# EAGLE design ds_gig_master (EAGLE 5.02)
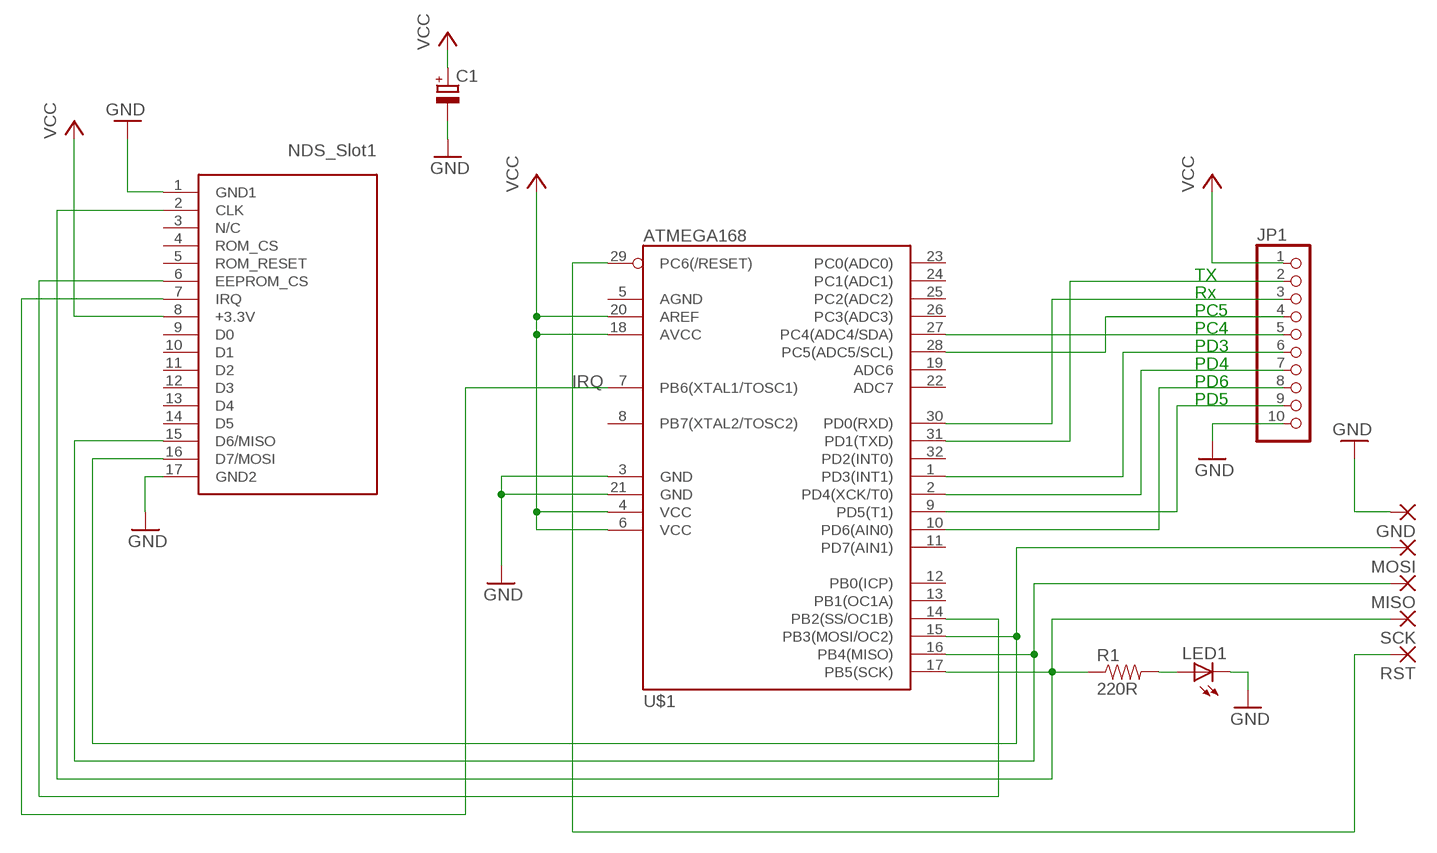
[diagram p0: schematic, sheet 1]

## Parts
C1  CPOL-EUSMCA  [SMC_A]
GND  SMD2  [SMD2]
JP1  PINHD-1X10  [1X10]
LED1  LED0603  [LED-0603]
MISO  SMD2  [SMD2]
MOSI  SMD2  [SMD2]
R1  220R  RESISTOR1206  [1206]
RST  SMD2  [SMD2]
SCK  SMD2  [SMD2]
U$1  ATMEGA168  [TQFP32-08]
U$2  M3_CARTRIDGE  [M3_CARTRIDGE]

## Nets
GND: C1.- GND.1(P) JP1.10 LED1.C U$1.3(GND) U$1.21(GND) U$2.1(GND1) U$2.17(GND2)
N$1: JP1.3 U$1.30(PD0(RXD))
N$2: R1.1 SCK.1(P) U$1.17(PB5(SCK)) U$2.2(CLK)
N$3: JP1.5 U$1.27(PC4(ADC4/SDA))
N$4: LED1.A R1.2
N$5: JP1.2 U$1.31(PD1(TXD))
N$6: U$1.14(PB2(SS/OC1B)) U$2.6(EEPROM_CS)
N$7: JP1.4 U$1.28(PC5(ADC5/SCL))
N$8: MISO.1(P) U$1.16(PB4(MISO)) U$2.15(D6/MISO)
N$9: JP1.9 U$1.9(PD5(T1))
N$11: JP1.6 U$1.1(PD3(INT1))
N$12: JP1.7 U$1.2(PD4(XCK/T0))
N$13: U$1.7(PB6(XTAL1/TOSC1)) U$2.7(IRQ)
N$15: JP1.8 U$1.10(PD6(AIN0))
N$16: RST.1(P) U$1.29(PC6(/RESET))
NNNN: MOSI.1(P) U$1.15(PB3(MOSI/OC2)) U$2.16(D7/MOSI)
VCC: C1.+ JP1.1 U$1.4(VCC) U$1.6(VCC) U$1.18(AVCC) U$1.20(AREF) U$2.8(+3.3V)
Unconnected: U$1.5(AGND) U$1.8(PB7(XTAL2/TOSC2)) U$1.11(PD7(AIN1)) U$1.12(PB0(ICP)) U$1.13(PB1(OC1A)) U$1.19(ADC6) U$1.22(ADC7) U$1.23(PC0(ADC0)) U$1.24(PC1(ADC1)) U$1.25(PC2(ADC2)) U$1.26(PC3(ADC3)) U$1.32(PD2(INT0)) U$2.3(N/C) U$2.4(ROM_CS) U$2.5(ROM_RESET) U$2.9(D0) U$2.10(D1) U$2.11(D2) U$2.12(D3) U$2.13(D4) U$2.14(D5)

## Notes on the sheet
- TX
- Rx
- PC5
- PC4
- PD3
- PD4
- IRQ | PD6
- PD5

## Library data of the parts
C1 = rcl:CPOL-EU: POLARIZED CAPACITOR, European symbol
GND MISO MOSI RST SCK = wirepad:SMD2: SMD PAD
JP1 = pinhead:PINHD-1X10: PIN HEADER
LED1 = SparkFunEagle-6-6-07:LED: LEDs Standard schematic elements and footprints for 5mm, 3mm, 1206, and 0603 sized LEDs. 5mm - Spark Fun Electronics SKU : COM-00529 (and others)
R1 = SparkFunEagle-6-6-07:RESISTOR: Resistor Basic schematic elements and footprints for 0603, 1206, and PTH 1/10th watt (small) resistors.
U$1 = SparkFunEagle-6-6-07:ATMEGA168
U$2 = nds_cart1:M3_CARTRIDGE

## Board
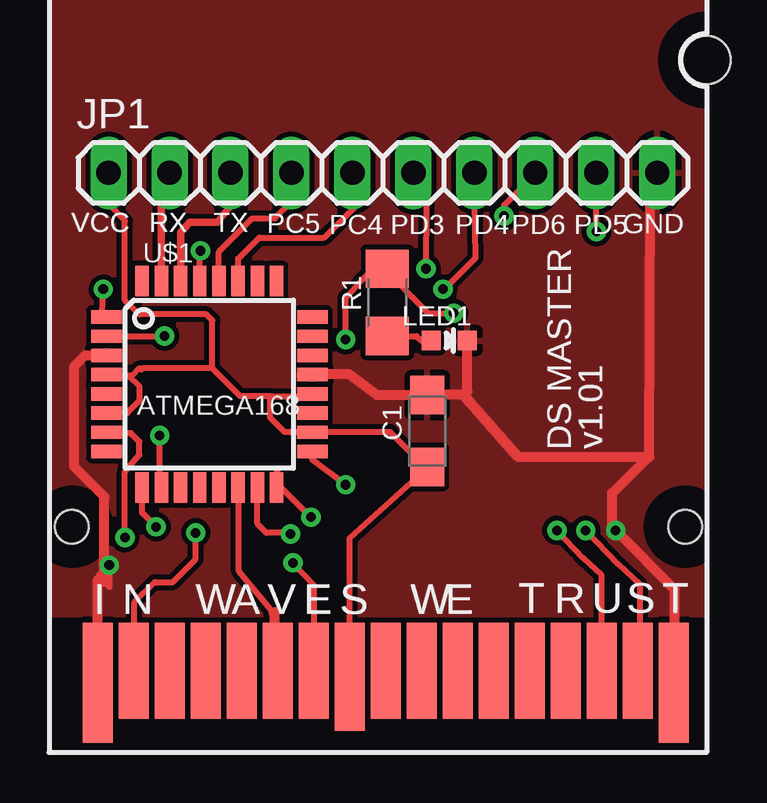
[diagram p1: board, top side]
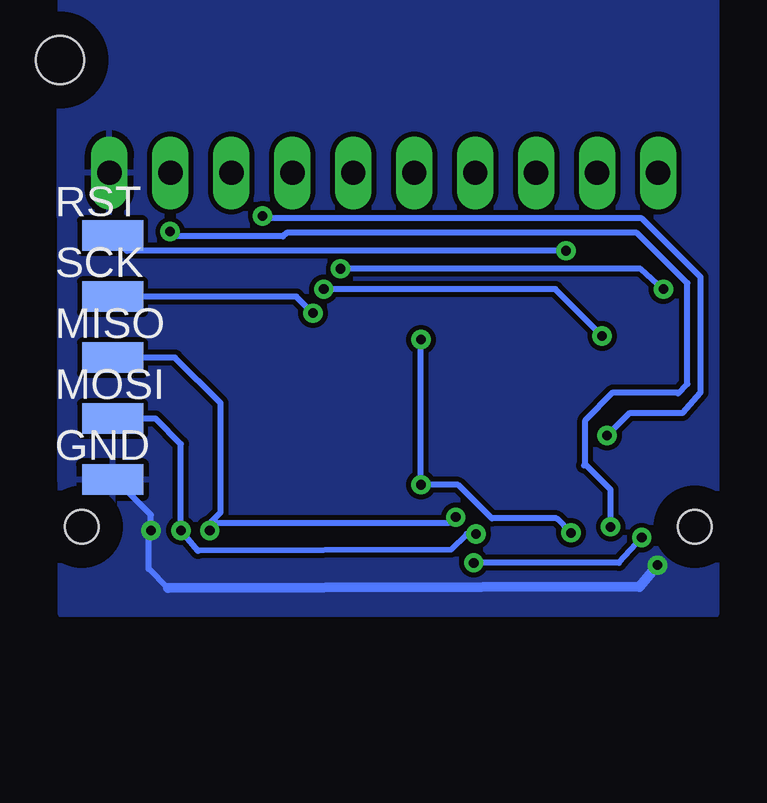
[diagram p2: board, bottom side, seen from below]

No outline drawn. Coordinates in mm, seen from the top.
Copper layers (1*16): Top 0.035mm / dielectric 1.5mm / Bottom 0.035mm
Design rules "default": minimum track width 10mil, minimum drill 24mil, track to track 8mil, track to pad 8mil, pad to pad 8mil, via to via 8mil, smd to smd 8mil, copper to edge 40mil, drill to drill 8mil, minimum pad ring 10mil, minimum via ring 8mil, stop-mask expansion 4mil, vias tented up to drill 0mil, thermal gap 10mil

### Footprints (pad centres in the part's own frame; a part is rotated, then mirrored left to right if it is on the bottom)
SMC_A = smd 1.6 x 1.4: + -1.5,0; - 1.5,0
SMD2 = smd 1.27 x 2.54: 1 0,0
1X10 = drill 1.016 long: 1 -11.43,0; 2 -8.89,0; 3 -6.35,0; 4 -3.81,0; 5 -1.27,0; 6 1.27,0; 7 3.81,0; 8 6.35,0; 9 8.89,0; 10 11.43,0
LED-0603 = smd 0.8 x 0.8: A 0,-0.75; C 0,0.75
1206 = smd 1.6 x 1.8: 1 -1.4,0; 2 1.4,0
TQFP32-08 = smd 1.27 x 0.559: 1 -4.293,2.8; 2 -4.293,2; 3 -4.293,1.2; 4 -4.293,0.4; 5 -4.293,-0.4; 6 -4.293,-1.2; 7 -4.293,-2; 8 -4.293,-2.8; 17 4.293,-2.8; 18 4.293,-2; 19 4.293,-1.2; 20 4.293,-0.4; 21 4.293,0.4; 22 4.293,1.2; 23 4.293,2; 24 4.293,2.8 | smd 0.559 x 1.27: 9 -2.8,-4.293; 10 -2,-4.293; 11 -1.2,-4.293; 12 -0.4,-4.293; 13 0.4,-4.293; 14 1.2,-4.293; 15 2,-4.293; 16 2.8,-4.293; 25 2.8,4.293; 26 2,4.293; 27 1.2,4.293; 28 0.4,4.293; 29 -0.4,4.293; 30 -1.2,4.293; 31 -2,4.293; 32 -2.8,4.293
M3_CARTRIDGE = smd 1.25 x 5: 1 1.975,3; 17 25.975,3 | smd 1.25 x 4: 2 3.475,3.5; 3 4.975,3.5; 4 6.475,3.5; 5 7.975,3.5; 6 9.475,3.5; 7 10.975,3.5; 9 13.975,3.5; 10 15.475,3.5; 11 16.975,3.5; 12 18.475,3.5; 13 19.975,3.5; 14 21.475,3.5; 15 22.975,3.5; 16 24.475,3.5 | smd 1.25 x 4.5: 8 12.475,3.25 | hole 1.4: 0.9,9.5; 26.45,9.5 | hole 2: 27.35,28.95

### Placement (x,y rotation side)
C1  15.65,13.44 90 top
GND  25.1,11.42 270 bottom
JP1  13.8,24.2 0 top
LED1  16.57,17.21 270 top
MISO  25.1,16.5 270 bottom
MOSI  25.1,13.96 270 bottom
R1  13.98,18.8 270 top
RST  25.1,21.58 270 bottom
SCK  25.1,19.04 270 bottom
U$1  6.57,15.39 0 top
U$2  -0.06,-0.05 0 top

### Tracks (layer width: path | path; a pad name or v marks a point on that pad's centre or on a via)
GND  (via drill 0.4)
  Top 0.254: 25.95,3.1 25.9,3.05 25.91,3.04 U$2.17 25.91,2.94 25.95,2.9 | JP1.10 25.2,24.2 25.15,24.2 25.1,24.25 | C1.- 15.71,14.94 15.75,14.9 15.8,14.95 | 17.15,14.95 17.32,15.08 | v23.5,9.3 23.35,9.45 | v2.4,7.85 2.4,6.95 2.2,7.15
  Top 0.305: 10.86,15.76 10.85,15.75 | 10.86,15.76 U$1.21 | 10.9,15.8 10.86,15.76
  Top 0.406: C1.- 13.56,14.94 12.4,15.8 10.9,15.8 | 25.2,24.2 24.95,23.55 24.9,12.35 24.85,12.35 | 24.85,12.35 19.45,12.35 17.15,14.95 15.8,14.95 | 17.32,15.08 LED1.C | 25.95,2.9 25.95,6.85 v23.5,9.3 | 24.85,12.35 23.35,10.85 23.35,9.45 | U$2.1 1.92,7.21 v2.4,7.85 | U$1.3 1.39,16.59 0.95,16.15 0.95,11.95 2.2,10.7 2.2,7.15
  Bottom 0.254: 24.9,11.2 25.1,11.4 GND.1 25.1,11.45 25.05,11.5 23.5,9.95 v23.5,9.3 23.5,9.25 23.6,9.15 23.6,7.7 22.8,6.9
  Bottom 0.406: 22.8,6.9 3.15,6.95 v2.4,7.85
  pour Top: -0.05,5.8 27.25,5.8 27.3,27.8 arc-90 26.2,28.9 26.2,29.05 arc-90 27.2,30.05 27.3,30.05 27.25,30.05 27.25,31.45 -0.05,31.45
  pour Bottom: -0.05,5.8 27.25,5.8 27.3,27.8 arc-90 26.2,28.9 26.2,29.05 arc-90 27.2,30.05 27.3,30.05 27.25,30.05 27.25,31.45 -0.05,31.45
N$1
  Top 0.305: U$1.30 5.37,21.72 5.75,22.15 6.9,22.15 7.45,22.8 7.45,23.95 7.4,24 7.45,24.05 JP1.3
N$2  (via drill 0.4)
  Top 0.254: U$1.17 10.86,12.24 v12.25,11.2 | v6,9.2 6,8.1 5.05,7.15 4.3,7.15 3.45,6.3 3.45,3.5 3.5,3.45 U$2.2 | v16.75,18.35 15.7,18.35 13.85,20.2 R1.1 13.35,20.2 12.25,19 v12.25,17.25
  Bottom 0.254: v6,9.2 6.6,9.8 9.3,9.8 10.7,11.2 v12.25,11.2 v12.25,17.25 | SCK.1 17.44,19.04 v16.75,18.35
N$3
  Top 0.254: U$1.27 7.77,20.62 8.65,21.5 11.35,21.5 12.6,22.75 12.6,24.05 12.5,24.15 12.53,24.18 JP1.5
N$4
  Top 0.254: 15.34,17.26 15.4,17.2 | 15.34,17.26 LED1.A | R1.2 15.2,17.4 15.34,17.26
N$5
  Top 0.305: JP1.2 5,24.2 4.57,23.77 U$1.31
N$6
  Top 0.254: 9.35,5.75 9.25,5.85 7.8,7.6 7.8,11.1
  Top 0.406: 7.8,11.1 U$1.14 | 9.3,5.85 9.3,5.9 | 9.3,5.85 9.25,5.85 | U$2.6 9.3,3.45 9.3,5.85
N$7
  Top 0.254: U$1.28 6.97,20.92 8.35,22.3 9.3,22.3 10,23 10,24 10.1,24.1 JP1.4
N$8  (via drill 0.4)
  Top 0.254: 9.4,11.8 9.4,11.1 9.55,11.1 v10.8,9.85 | v21.05,9.3 22.15,8.15 22.9,7.45 22.9,3.65 23,3.55 22.91,3.46 U$2.15
  Top 0.406: 9.4,11.1 U$1.16
  Bottom 0.254: MISO.1 22.5,16.5 20.6,14.6 20.6,10.05 21.05,9.6 | 21.05,9.6 v21.05,9.3 | v10.8,9.85 10.85,9.85 11.1,9.6 21.05,9.6
N$9  (via drill 0.4)
  Top 0.254: U$1.9 3.77,10.03 v4.35,9.45 | JP1.9 22.69,24.11 22.75,24.05 22.7,24 v22.7,21.75
  Bottom 0.254: v4.35,9.45 4.35,11 5.4,12.05 | 22.75,24.25 JP1.9 | 5.4,12.05 5.4,13.9 4.25,15.05 1.55,15.05 1.55,15 1.15,15.4 1.15,19.6 3.25,21.7 17.85,21.7 18,21.55 22.5,21.55 v22.7,21.75 | 5.4,12.05 5.45,12
N$11  (via drill 0.4)
  Top 0.254: JP1.6 15.62,22.93 v15.6,20.2 | U$1.1 2.34,18.19 2.35,18.2 2.1,18.35 v2.15,19.35
  Bottom 0.254: v15.6,20.2 3.1,20.2 v2.15,19.35
N$12  (via drill 0.4)
  Top 0.254: U$1.2 2.31,17.39 2.35,17.35 2.4,17.4 v4.7,17.4 | v16.3,19.35 16.35,19.35 17.66,20.66 JP1.7
  Bottom 0.254: v16.3,19.35 6.65,19.35 v4.7,17.4
N$13  (via drill 0.4)
  Top 0.254: U$2.7 10.91,7.04 v10.05,7.95 | v3.05,9 3.05,11.75 3.65,12.45 3.65,13 3.3,13.35 2.3,13.35 2.28,13.33 | 2.28,13.33 2.25,13.3 | 2.28,13.33 U$1.7
  Bottom 0.254: v10.05,7.95 4,7.95 v3.05,9
N$15  (via drill 0.4)
  Top 0.254: JP1.8 20.2,24.2 18.85,22.85 v18.85,22.4 | U$1.10 4.57,11.12 4.6,11.15 4.5,11.25 v4.5,13.25
  Bottom 0.254: v18.85,22.4 18.8,22.3 3.05,22.3 0.6,19.85 0.6,15.05 1.35,14.2 3.55,14.2 v4.5,13.25
N$16  (via drill 0.4)
  Top 0.254: U$1.29 6.17,20.92 v6.2,20.95
  Bottom 0.254: 25.13,21.58 25.15,21.6 | 25.13,21.58 RST.1 | v6.2,20.95 24.5,20.95 25.13,21.58
NNNN  (via drill 0.4)
  Top 0.254: U$1.15 8.57,9.58 8.95,9.2 9.9,9.2 v9.95,9.15 | v22.25,9.3 23.6,7.9 24.5,7.05 24.5,3.7 24.4,3.6 24.41,3.58 U$2.16
  Bottom 0.254: v9.95,9.15 10.35,9.15 11,8.5 21.55,8.45 v22.25,9.3 22.2,9.35 22.25,9.4 22.25,12.9 23.31,13.96 MOSI.1
VCC
  Top 0.254: JP1.1 2.37,22.88 3.05,22.2 3.05,18.9 3.65,18.3 6.45,18.3 6.7,18.05 6.7,16.05 | 2.35,15.75 2.31,15.79 U$1.4 | 2.35,15.75 3.35,15.75 3.65,16.05 3.7,16.05 3.75,16 3.8,16.05 6.7,16.05 | 9.1,14.9 7.85,14.9 6.7,16.05 | 9.1,14.9 10.8,14.9 | 9.1,14.9 9.1,14 9.71,13.39 U$1.18 14.11,13.39 15.6,11.9 C1.+ 15.65,11.9 12.41,8.96 U$2.8 | 2.35,15.75 3.2,15.75 3.65,15.3 3.65,14.7 3.15,14.2 2.45,14.2 2.35,14.1 2.28,14.17 U$1.6
  Top 0.406: 10.89,14.99 10.9,15 | 10.89,14.99 U$1.20 | 10.8,14.9 10.89,14.99

### Text on the board
tPlace: PC5 | PC4 | PD3 | PD4 | PD6 | PD5 | DS MASTER | v1.01
tNames: VCC | RX | TX | GND
_tsilk: VCC | RX | TX | PC5 | PC4 | PD3 | PD4 | PD6 | PD5 | GND | R1 | LED1 | ATMEGA168 | C1 | DS MASTER | v1.01 | I | N | W | A | V | E | S | W | E | T | R | U | S | T